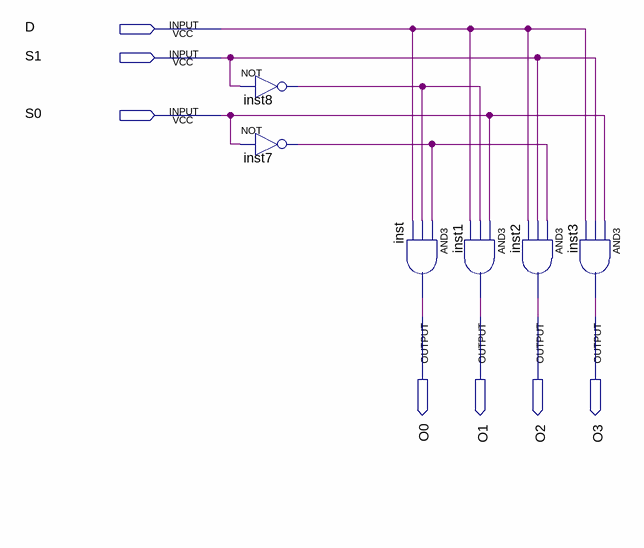
[diagram p0: schematic sheet]
// Quartus schematic demultiplexer_1_4.bdf as structural Verilog: 6 symbols, 7 pins
module demultiplexer_1_4 (
  input  D,
  input  S1,
  input  S0,
  output O0,
  output O1,
  output O2,
  output O3
);

  wire inst7_out, inst8_out;

  not inst8 (inst8_out, S1);
  not inst7 (inst7_out, S0);
  and inst (O0, inst7_out, inst8_out, D);
  and inst1 (O1, S0, inst8_out, D);
  and inst2 (O2, inst7_out, S1, D);
  and inst3 (O3, S0, S1, D);
endmodule
